# Altium project STM32F417 Demo Board.PrjPcb (part 3 of 4)

## Sheet Ethernet.SchDoc
size A3; SheetNumber: 6; SheetTotal: 15
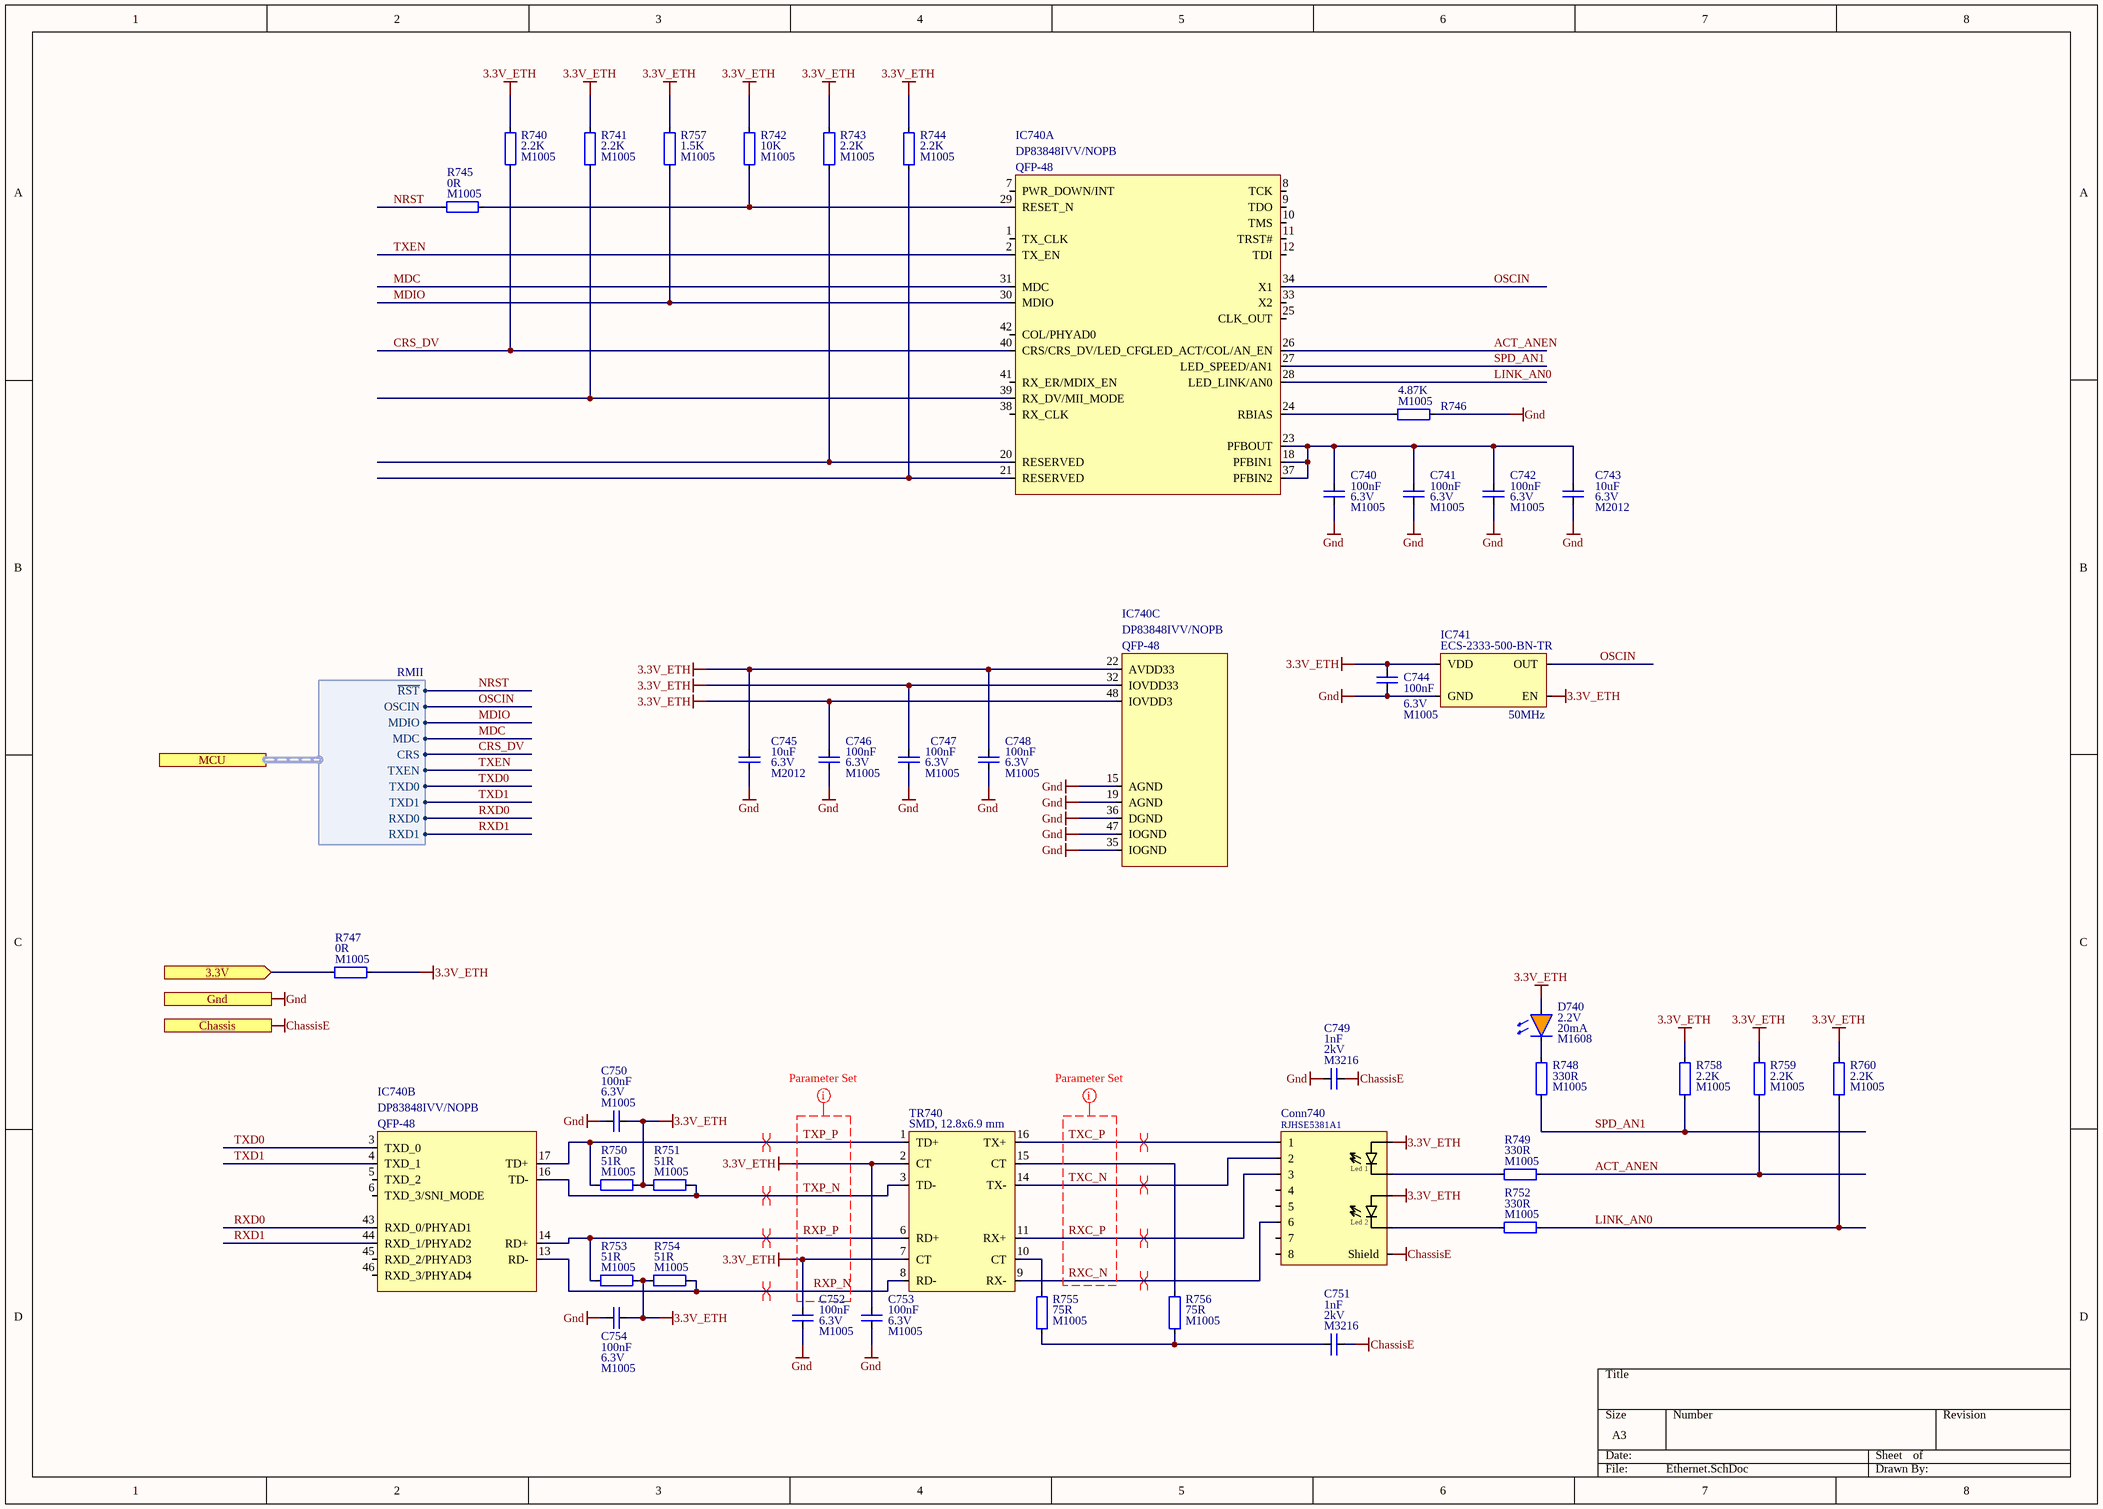
[diagram p9: Ethernet.SchDoc]

### Parts
C740  value 100nF  Voltage: 6.3V  Package: M1005  [Capacitor_Ceramic_M1005_I0402]  (hidden comment: Capacitor_Ceramic)
C741  value 100nF  Voltage: 6.3V  Package: M1005  [Capacitor_Ceramic_M1005_I0402]  (hidden comment: Capacitor_Ceramic)
C742  value 100nF  Voltage: 6.3V  Package: M1005  [Capacitor_Ceramic_M1005_I0402]  (hidden comment: Capacitor_Ceramic)
C743  value 10uF  Voltage: 6.3V  Package: M2012  [Capacitor_Ceramic_M2012_I0805]  (hidden comment: Capacitor_Ceramic)
C744  value 100nF  Voltage: 6.3V  Package: M1005  [Capacitor_Ceramic_M1005_I0402]  (hidden comment: Capacitor_Ceramic)
C745  value 10uF  Voltage: 6.3V  Package: M2012  [Capacitor_Ceramic_M2012_I0805]  (hidden comment: Capacitor_Ceramic)
C746  value 100nF  Voltage: 6.3V  Package: M1005  [Capacitor_Ceramic_M1005_I0402]  (hidden comment: Capacitor_Ceramic)
C747  value 100nF  Voltage: 6.3V  Package: M1005  [Capacitor_Ceramic_M1005_I0402]  (hidden comment: Capacitor_Ceramic)
C748  value 100nF  Voltage: 6.3V  Package: M1005  [Capacitor_Ceramic_M1005_I0402]  (hidden comment: Capacitor_Ceramic)
C749  value 1nF  Voltage: 2kV  Package: M3216  [Capacitor_Ceramic_M3216_I1206]  (hidden comment: Capacitor_Ceramic)
C750  value 100nF  Voltage: 6.3V  Package: M1005  [Capacitor_Ceramic_M1005_I0402]  (hidden comment: Capacitor_Ceramic)
C751  value 1nF  Voltage: 2kV  Package: M3216  [Capacitor_Ceramic_M3216_I1206]  (hidden comment: Capacitor_Ceramic)
C752  value 100nF  Voltage: 6.3V  Package: M1005  [Capacitor_Ceramic_M1005_I0402]  (hidden comment: Capacitor_Ceramic)
C753  value 100nF  Voltage: 6.3V  Package: M1005  [Capacitor_Ceramic_M1005_I0402]  (hidden comment: Capacitor_Ceramic)
C754  value 100nF  Voltage: 6.3V  Package: M1005  [Capacitor_Ceramic_M1005_I0402]  (hidden comment: Capacitor_Ceramic)
Conn740  Manufacturer Part Number: RJHSE5381A1  [RJ45 - Amphenol, RJHSE-x38x-A1]  (hidden comment: RJ45 - Amphenol, RJHSE-x38x-A1)
D740  Current: 20mA  Voltage: 2.2V  Package: M1608  [Diode_Smd_M1608_I0603_Orange1]  (hidden comment: Diode_Led)
IC740  Manufacturer Part Number: DP83848IVV/NOPB  Package: QFP-48  [QFP-48, 7mm x 7mm, 0.5mm]  (hidden comment: Ethernet - Texas, DP83848xVV)  (parts A,B,C of 3)
IC741  Frequency: 50MHz  Manufacturer Part Number: ECS-2333-500-BN-TR  [Clock Oscillator - ECS, ECS-2325, ECS-2333]  (hidden comment: Clock Oscillator - ECS, ECS-2325, ECS-2333)
R740  value 2.2K  Package: M1005  [Resistor_Smd_M1005_I0402]  (hidden comment: Resistor)
R741  value 2.2K  Package: M1005  [Resistor_Smd_M1005_I0402]  (hidden comment: Resistor)
R742  value 10K  Package: M1005  [Resistor_Smd_M1005_I0402]  (hidden comment: Resistor)
R743  value 2.2K  Package: M1005  [Resistor_Smd_M1005_I0402]  (hidden comment: Resistor)
R744  value 2.2K  Package: M1005  [Resistor_Smd_M1005_I0402]  (hidden comment: Resistor)
R745  value 0R  Package: M1005  [Resistor_Smd_M1005_I0402]  (hidden comment: Resistor)
R746  value 4.87K  Package: M1005  [Resistor_Smd_M1005_I0402]  (hidden comment: Resistor)
R747  value 0R  Package: M1005  [Resistor_Smd_M1005_I0402]  (hidden comment: Resistor)
R748  value 330R  Package: M1005  [Resistor_Smd_M1005_I0402]  (hidden comment: Resistor)
R749  value 330R  Package: M1005  [Resistor_Smd_M1005_I0402]  (hidden comment: Resistor)
R750  value 51R  Package: M1005  [Resistor_Smd_M1005_I0402]  (hidden comment: Resistor)
R751  value 51R  Package: M1005  [Resistor_Smd_M1005_I0402]  (hidden comment: Resistor)
R752  value 330R  Package: M1005  [Resistor_Smd_M1005_I0402]  (hidden comment: Resistor)
R753  value 51R  Package: M1005  [Resistor_Smd_M1005_I0402]  (hidden comment: Resistor)
R754  value 51R  Package: M1005  [Resistor_Smd_M1005_I0402]  (hidden comment: Resistor)
R755  value 75R  Package: M1005  [Resistor_Smd_M1005_I0402]  (hidden comment: Resistor)
R756  value 75R  Package: M1005  [Resistor_Smd_M1005_I0402]  (hidden comment: Resistor)
R757  value 1.5K  Package: M1005  [Resistor_Smd_M1005_I0402]  (hidden comment: Resistor)
R758  value 2.2K  Package: M1005  [Resistor_Smd_M1005_I0402]  (hidden comment: Resistor)
R759  value 2.2K  Package: M1005  [Resistor_Smd_M1005_I0402]  (hidden comment: Resistor)
R760  value 2.2K  Package: M1005  [Resistor_Smd_M1005_I0402]  (hidden comment: Resistor)
TR740  Package: SMD, 12.8x6.9 mm  [Transformer, Pulse - Bourns, SM13126PEL]  (hidden comment: Transformer, Pulse - Bourns, SM13126PEL)

### Ports
3.3V (in), Chassis (in), Gnd (in), MCU (harness RMII)

### Harnesses
RMII: ~{RST}, OSCIN, MDIO, CRS, MDC, TXEN, TXD0, TXD1, RXD0, RXD1

### Nets
3.3V: R747.1 ; port 3.3V
3.3V_ETH: C744.1 C745.1 C746.1 C747.1 C748.1 C750.2 C752.1 C753.1 C754.2 Conn740.L1-A Conn740.L2-A D740.A IC740.22(AVDD33) IC740.32(IOVDD33) IC740.48(IOVDD3) IC741.EN IC741.VDD R740.1 R741.1 R742.1 R743.1 R744.1 R747.2 R750.2 R751.1 R753.2 R754.1 R757.1 R758.1 R759.1 R760.1 TR740.2(CT) TR740.7(CT)
ChassisE: C749.2 C751.2 Conn740.Shield ; port Chassis
Gnd: C740.2 C741.2 C742.2 C743.2 C744.2 C745.2 C746.2 C747.2 C748.2 C749.1 C750.1 C752.2 C753.2 C754.1 IC740.15(AGND) IC740.19(AGND) IC740.35(IOGND) IC740.36(DGND) IC740.47(IOGND) IC741.GND R746.2 ; port Gnd
ACT_ANEN: IC740.26(LED_ACT/COL/AN_EN) R749.2 R759.2
CRS_DV: IC740.40(CRS/CRS_DV/LED_CFG) R740.2 ; port MCU.CRS
LINK_AN0: IC740.28(LED_LINK/AN0) R752.2 R760.2
MDC: IC740.31(MDC) ; port MCU.MDC
MDIO: IC740.30(MDIO) R757.2 ; port MCU.MDIO
NRST: R745.1 ; port MCU.~{RST}
OSCIN: IC740.34(X1) IC741.OUT ; port MCU.OSCIN
RXC_N: Conn740.6 TR740.9(RX-)
RXC_P: Conn740.3 TR740.11(RX+)
RXD0: IC740.43(RXD_0/PHYAD1) ; port MCU.RXD0  [project net PC4]
RXD1: IC740.44(RXD_1/PHYAD2) ; port MCU.RXD1  [project net PC5]
RXP_N: IC740.13(RD-) R754.2 TR740.8(RD-)
RXP_P: IC740.14(RD+) R753.1 TR740.6(RD+)
SPD_AN1: IC740.27(LED_SPEED/AN1) R748.2 R758.2
TXC_N: Conn740.2 TR740.14(TX-)
TXC_P: Conn740.1 TR740.16(TX+)
TXD0: IC740.3(TXD_0) ; port MCU.TXD0  [project net PB12]
TXD1: IC740.4(TXD_1) ; port MCU.TXD1  [project net PB13]
TXEN: IC740.2(TX_EN) ; port MCU.TXEN  [project net PB11]
TXP_N: IC740.16(TD-) R751.2 TR740.3(TD-)
TXP_P: IC740.17(TD+) R750.1 TR740.1(TD+)
NetC740_1: C740.1 C741.1 C742.1 C743.1 IC740.18(PFBIN1) IC740.23(PFBOUT) IC740.37(PFBIN2)
NetC751_1: C751.1 R755.2 R756.2
NetConn740_L1-C: Conn740.L1-C R749.1
NetConn740_L2-C: Conn740.L2-C R752.1
NetD740_C: D740.C R748.1
NetIC740_20: IC740.20(RESERVED) R743.2
NetIC740_21: IC740.21(RESERVED) R744.2
NetIC740_24: IC740.24(RBIAS) R746.1
NetIC740_29: IC740.29(RESET_N) R742.2 R745.2
NetIC740_39: IC740.39(RX_DV/MII_MODE) R741.2
NetR755_1: R755.1 TR740.10(CT)
NetR756_1: R756.1 TR740.15(CT)

Not connected (* = marked no-connect by the designer): Conn740 4 5 7 8; IC740 1(TX_CLK) 5(TXD_2) 6(TXD_3/SNI_MODE) 7(PWR_DOWN/INT) 8(TCK) 9(TDO) 10(TMS) 11(TRST#) 12(TDI) 25(CLK_OUT) 33(X2) 38(RX_CLK) 41(RX_ER/MDIX_EN) 42(COL/PHYAD0) 45(RXD_2/PHYAD3) 46(RXD_3/PHYAD4)

### Layout directives
differential pair; differential pair class Eth_100: RXC_N, RXC_P, RXP_N, RXP_P, TXC_N, TXC_P, TXP_N, TXP_P
net class EthP: RXP_N, RXP_P, TXP_N, TXP_P
net class EthC: RXC_N, RXC_P, TXC_N, TXC_P

### Notes on the sheet
- (in symbol RJ45 - Amphenol, RJHSE-x38x-A1) Led 1; Led 2

### Library data of the parts
C740-C742 C744 C746-C748 C750 C752-C754 = Capacitor_Ceramic: as C700 on sheet Microcontroller; ComponentLink1Description: Datasheet; ComponentLink1URL: E:\Altium\Datasheets\Capacitor\Kyocera - X5R.pdf; ComponentLink2Description: Supplier Link; ComponentLink2URL: https://www.digikey.com/en/products/detail/kyocera-avx/04026D104KAT4A/8107673; Supplier: Digikey; Supplier Part Number: 478-11504-1-ND; Operating Temperature, Min: +85℃; Operating Temperature, Max: -55℃; Quantity, Min: 1; Quantity, Max: 250000; Price, Min: 0.1; Supplier Currency: $; Price, Max: 0.00189; Supplier Link: https://www.digikey.com/en/products/detail/kyocera-avx/04026D104KAT4A/8107673; Component Type: Ceramic; Component Category: Capacitor
C743 C745 = Capacitor_Ceramic: Cap, Cer, 10uF, 6.3V, M2012; Manufacturer Part Number: CL21A106MQFNNNE; Manufacturer: Samsung; Temperature Coefficient: X5R; Tolerance: 20%; ComponentLink1Description: Datasheet; ComponentLink1URL: E:\Altium\Datasheets\Capacitor\Samsung - Multi Layer Ceramic Capacitors.pdf; ComponentLink2Description: Supplier Link; ComponentLink2URL: https://www.digikey.com/en/products/detail/samsung-electro-mechanics/CL21A106MQFNNNE/3886956; Supplier: Digikey; Supplier Part Number: 1276-1298-1-ND; Operating Temperature, Min: +85℃; Operating Temperature, Max: -55℃; Quantity, Min: 1; Quantity, Max: 200000; Price, Min: 0.1; Supplier Currency: $; Price, Max: 0.0087; Supplier Link: https://www.digikey.com/en/products/detail/samsung-electro-mechanics/CL21A106MQFNNNE/3886956; Component Type: Ceramic; Component Category: Capacitor
C749 C751 = Capacitor_Ceramic: Cap, Cer, 1nF, 2kV, M3216; Manufacturer Part Number: CC1206MKX7RDBB102; Manufacturer: Yageo; Temperature Coefficient: X7R; Tolerance: 20%; ComponentLink1Description: Datasheet; ComponentLink1URL: E:\Altium\Datasheets\Capacitor\Yageo - Surface-Mount Ceramic Multilayer Capacitors.pdf; ComponentLink2Description: Supplier Link; ComponentLink2URL: https://www.digikey.com/en/products/detail/yageo/CC1206MKX7RDBB102/5884663; Supplier: Digikey; Supplier Part Number: 311-4501-1-ND; Operating Temperature, Min: +125℃; Operating Temperature, Max: -55℃; Quantity, Min: 1; Quantity, Max: 300000; Price, Min: 0.23; Supplier Currency: $; Price, Max: 0.03271; Supplier Link: https://www.digikey.com/en/products/detail/yageo/CC1206MKX7RDBB102/5884663; Component Type: Ceramic; Component Category: Capacitor
Conn740 = RJ45 - Amphenol, RJHSE-x38x-A1: Conn, RJ45, 2 Leds, Shielded, Side Entry; Component Category: Connector; ComponentLink1Description: Datasheet; ComponentLink1URL: E:\Altium\Datasheets\Connector - Registered Jack\RJ45 - Amphenol, RJHSE-x38x-A1.pdf; ComponentLink2Description: Supplier Link; ComponentLink2URL: https://www.digikey.com/en/products/detail/amphenol-cs-commercial-products/RJHSE5381A1/3083556; Supplier: Digikey; Supplier Part Number: RJHSE5381A1-ND; Manufacturer: Amphenol; Operating Temperature, Min: -55℃; Operating Temperature, Max: +85℃; Quantity, Min: 1; Quantity, Max: 2400; Price, Min: 1.51; Supplier Currency: $; Price, Max: 0.806; Supplier Link: https://www.digikey.com/en/products/detail/amphenol-cs-commercial-products/RJHSE5381A1/3083556; Component Type: PCB; Package: RJ45
D740 = Diode_Led: Diode, Led, Orange, 2.2V, 20mA, M1608; Manufacturer Part Number: SML-D12D1WT86; Manufacturer: Rohm; ComponentLink1Description: Datasheet; ComponentLink1URL: E:\Altium\Datasheets\Diode\Rohm, SML-D12x1 Series.pdf; ComponentLink2Description: Supplier Link; ComponentLink2URL: https://www.digikey.com/en/products/detail/rohm-semiconductor/SML-D12D1WT86/5843854; Supplier: Digikey; Supplier Part Number: SML-D12D1WT86CT-ND; Operating Temperature, Min: -40℃; Operating Temperature, Max: +85℃; Quantity, Min: 1; Quantity, Max: 75000; Price, Min: 0.25; Price, Max: 0.02838; Supplier Currency: $; Supplier Link: https://www.digikey.com/en/products/detail/rohm-semiconductor/SML-D12D1WT86/5843854; Component Type: Led; Component Category: Diode
IC740 = Ethernet - Texas, DP83848xVV: IC, Interface, Eth Phy, 10/100Mb, DP83848IVV; ComponentLink1Description: Datasheet; ComponentLink1URL: E:\Altium\Datasheets\IC - Interface\Ethernet - Texas, DP83848.pdf; ComponentLink2Description: Supplier Link; ComponentLink2URL: https://www.digikey.com/en/products/detail/texas-instruments/DP83848IVV-NOPB/947543; Supplier: Digikey; Supplier Part Number: DP83848IVV/NOPB-ND; Manufacturer: Texas; Operating Temperature, Min: -40℃; Operating Temperature, Max: +85℃; Quantity, Min: 1; Quantity, Max: 1000; Price, Min: 6.45; Supplier Currency: $; Price, Max: 3.834; Supplier Link: https://www.digikey.com/en/products/detail/texas-instruments/DP83848IVV-NOPB/947543; Component Type: Interface; Component Category: IC
IC741 = Clock Oscillator - ECS, ECS-2325, ECS-2333: IC, Oscillator, 50MHz; ComponentLink1Description: Datasheet; ComponentLink1URL: E:\Altium\Datasheets\IC - Clock, Timing, Oscillator\Clock Oscillator - ECS, ECS-2325, ECS-2333.pdf; ComponentLink2Description: Supplier Link; ComponentLink2URL: https://www.digikey.com/en/products/detail/ecs-inc/ECS-2333-500-BN-TR/3927356; Supplier: Digikey; Supplier Part Number: XC1930CT-ND; Operating Temperature, Min: -40℃; Operating Temperature, Max: +85℃; Quantity, Min: 1; Quantity, Max: 10000; Price, Min: 1.24; Supplier Currency: $; Price, Max: 0.71656; Supplier Link: https://www.digikey.com/en/products/detail/ecs-inc/ECS-2333-500-BN-TR/3927356; Component Type: Clock, Timing, Oscillator; Component Category: IC; Manufacturer: ECS; Package: Flat, 3.2mm x 2.5mm
R740 R741 R743 R744 R758-R760 = Resistor: Res, 2.2K, 1%, M1005; Manufacturer: Yageo; Manufacturer Part Number: RC0402FR-072K2L; Component Category: Resistor; Component Type: Fixed Value; Tolerance: 1%; Supplier Link: https://www.digikey.com/en/products/detail/yageo/RC0402FR-072K2L/726553; Supplier Currency: $; Price, Max: 0.00129; Price, Min: 0.1; Quantity, Max: 100000; Quantity, Min: 1; Operating Temperature, Max: -55℃; Operating Temperature, Min: +155℃; Supplier Part Number: 311-2.20KLRCT-ND; Supplier: Digikey; ComponentLink1Description: Datasheet; ComponentLink1URL: E:\Altium\Datasheets\Resistor\Yageo - RC_L Series.pdf; ComponentLink2Description: Supplier Link; ComponentLink2URL: https://www.digikey.com/en/products/detail/yageo/RC0402FR-072K2L/726553
R742 = Resistor: as R706 on sheet Microcontroller; Component Category: Resistor; Component Type: Fixed Value; Tolerance: 1%; Supplier Link: https://www.digikey.com/en/products/detail/yageo/RC0402FR-0710KP/4935264; Supplier Currency: $; Price, Max: 0.00282; Price, Min: 0.1; Quantity, Max: 100000; Quantity, Min: 1; Operating Temperature, Max: -55℃; Operating Temperature, Min: +155℃; Supplier Part Number: YAG1249CT-ND; Supplier: Digikey; ComponentLink1Description: Datasheet; ComponentLink1URL: E:\Altium\Datasheets\Resistor\Yageo - RC_L Series.pdf; ComponentLink2Description: Supplier Link; ComponentLink2URL: https://www.digikey.com/en/products/detail/yageo/RC0402FR-0710KP/4935264
R745 R747 = Resistor: as R708 on sheet Microcontroller; Component Category: Resistor; Component Type: Fixed Value; Tolerance: *; Supplier Link: https://www.digikey.com/en/products/detail/yageo/RC0402FR-070RL/2827570; Supplier Currency: $; Price, Max: 0.00109; Price, Min: 0.1; Quantity, Max: 50000; Quantity, Min: 1; Operating Temperature, Max: -55℃; Operating Temperature, Min: +155℃; Supplier Part Number: 311-0.0LRCT-ND; Supplier: Digikey; ComponentLink1Description: Datasheet; ComponentLink1URL: E:\Altium\Datasheets\Resistor\Yageo - RC_L Series.pdf; ComponentLink2Description: Supplier Link; ComponentLink2URL: https://www.digikey.com/en/products/detail/yageo/RC0402FR-070RL/2827570
R746 = Resistor: Res, 4.87K, 1%, M1005; Manufacturer: Yageo; Manufacturer Part Number: RC0402FR-074K87L; Component Category: Resistor; Component Type: Fixed Value; Tolerance: 1%; Supplier Link: https://www.digikey.com/en/products/detail/yageo/RC0402FR-074K87L/5281035; Supplier Currency: $; Price, Max: 0.00129; Price, Min: 0.1; Quantity, Max: 100000; Quantity, Min: 1; Operating Temperature, Max: -55℃; Operating Temperature, Min: +155℃; Supplier Part Number: YAG3175CT-ND; Supplier: Digikey; ComponentLink1Description: Datasheet; ComponentLink1URL: E:\Altium\Datasheets\Resistor\Yageo - RC_L Series.pdf; ComponentLink2Description: Supplier Link; ComponentLink2URL: https://www.digikey.com/en/products/detail/yageo/RC0402FR-074K87L/5281035
R748 R749 R752 = Resistor: as R660 on sheet LCD; Component Category: Resistor; Component Type: Fixed Value; Tolerance: 1%; Supplier Link: https://www.digikey.com/en/products/detail/yageo/RC0402FR-07330RL/726594; Supplier Currency: $; Price, Max: 0.00129; Price, Min: 0.1; Quantity, Max: 100000; Quantity, Min: 1; Operating Temperature, Max: -55℃; Operating Temperature, Min: +155℃; Supplier Part Number: 311-330LRCT-ND; Supplier: Digikey; ComponentLink1Description: Datasheet; ComponentLink1URL: E:\Altium\Datasheets\Resistor\Yageo - RC_L Series.pdf; ComponentLink2Description: Supplier Link; ComponentLink2URL: https://www.digikey.com/en/products/detail/yageo/RC0402FR-07330RL/726594
R750 R751 R753 R754 = Resistor: Res, 51R, 1%, M1005; Manufacturer: Yageo; Manufacturer Part Number: RC0402FR-0751RL; Component Category: Resistor; Component Type: Fixed Value; Tolerance: 1%; Supplier Link: https://www.digikey.com/en/products/detail/yageo/RC0402FR-0751RL/726629; Supplier Currency: $; Price, Max: 0.00129; Price, Min: 0.1; Quantity, Max: 100000; Quantity, Min: 1; Operating Temperature, Max: -55℃; Operating Temperature, Min: +155℃; Supplier Part Number: 311-51.0LRCT-ND; Supplier: Digikey; ComponentLink1Description: Datasheet; ComponentLink1URL: E:\Altium\Datasheets\Resistor\Yageo - RC_L Series.pdf; ComponentLink2Description: Supplier Link; ComponentLink2URL: https://www.digikey.com/en/products/detail/yageo/RC0402FR-0751RL/726629
R755 R756 = Resistor: Res, 75R, 1%, M1005; Manufacturer: Yageo; Manufacturer Part Number: RC0402FR-0775RL; Component Category: Resistor; Component Type: Fixed Value; Tolerance: 1%; Supplier Link: https://www.digikey.com/en/products/detail/yageo/RC0402FR-0775RL/726658; Supplier Currency: $; Price, Max: 0.00129; Price, Min: 0.1; Quantity, Max: 100000; Quantity, Min: 1; Operating Temperature, Max: -55℃; Operating Temperature, Min: +155℃; Supplier Part Number: 311-75.0LRCT-ND; Supplier: Digikey; ComponentLink1Description: Datasheet; ComponentLink1URL: E:\Altium\Datasheets\Resistor\Yageo - RC_L Series.pdf; ComponentLink2Description: Supplier Link; ComponentLink2URL: https://www.digikey.com/en/products/detail/yageo/RC0402FR-0775RL/726658
R757 = Resistor: Res, 1.5K, 1%, M1005; Manufacturer: Yageo; Manufacturer Part Number: RC0402FR-071K5L; Component Category: Resistor; Component Type: Fixed Value; Tolerance: 1%; Supplier Link: https://www.digikey.com/en/products/detail/yageo/RC0402FR-071K5L/726519; Supplier Currency: $; Price, Max: 0.00129; Price, Min: 0.1; Quantity, Max: 100000; Quantity, Min: 1; Operating Temperature, Max: -55℃; Operating Temperature, Min: +155℃; Supplier Part Number: 311-1.50KLRCT-ND; Supplier: Digikey; ComponentLink1Description: Datasheet; ComponentLink1URL: E:\Altium\Datasheets\Resistor\Yageo - RC_L Series.pdf; ComponentLink2Description: Supplier Link; ComponentLink2URL: https://www.digikey.com/en/products/detail/yageo/RC0402FR-071K5L/726519
TR740 = Transformer, Pulse - Bourns, SM13126PEL: Transformer, Eth, 100Mbps, SM13126PEL; ComponentLink1Description: Datasheet; ComponentLink1URL: E:\Altium\Datasheets\Transformer\Transformer, Pulse - Bourns, SM51108PEL.pdf; ComponentLink2Description: Supplier Link; ComponentLink2URL: https://www.digikey.com/en/products/detail/bourns-inc/SM13126PEL/10229989; Manufacturer Part Number: SM13126PEL; Supplier: Digikey; Supplier Part Number: SM13126PELCT-ND; Manufacturer: Bourns; Operating Temperature, Min: -40℃; Operating Temperature, Max: +85℃; Quantity, Min: 1; Quantity, Max: 6000; Price, Min: 2.17; Price, Max: 1.05049; Supplier Currency: $; Supplier Link: https://www.digikey.com/en/products/detail/bourns-inc/SM13126PEL/10229989; Component Type: Pulse; Component Category: Transformer

## Sheet RS422.SchDoc
size A4; SheetNumber: 7; SheetTotal: 15
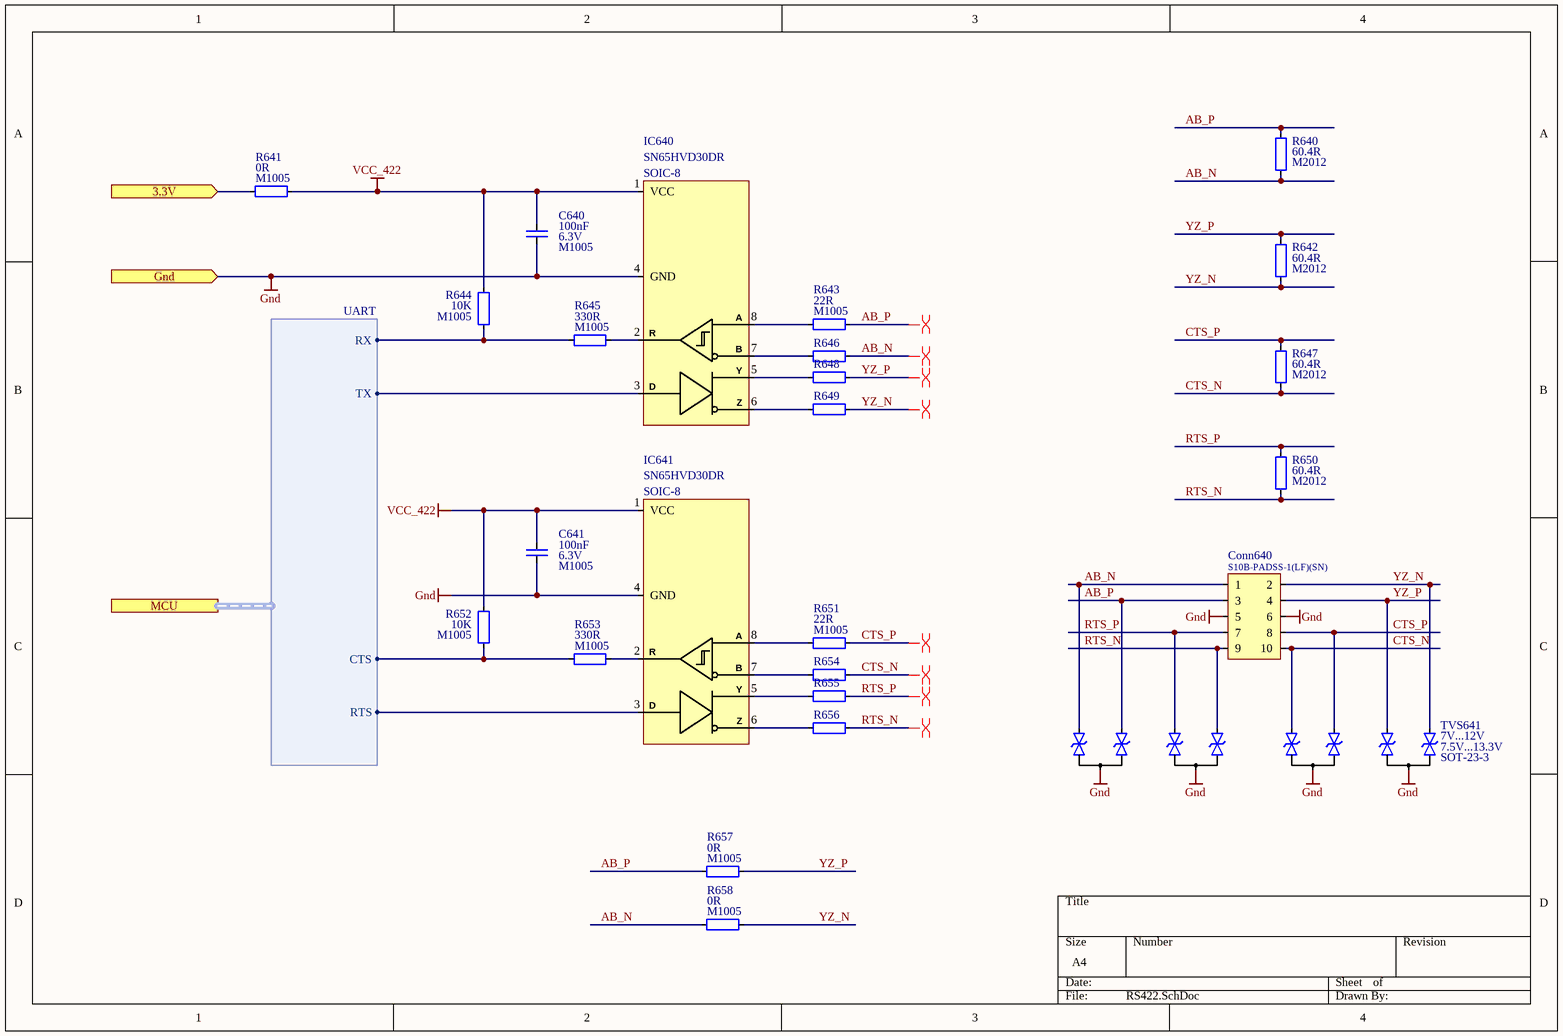
[diagram p10: RS422.SchDoc]

### Parts
C640  value 100nF  Voltage: 6.3V  Package: M1005  [Capacitor_Ceramic_M1005_I0402]  (hidden comment: Capacitor_Ceramic)
C641  value 100nF  Voltage: 6.3V  Package: M1005  [Capacitor_Ceramic_M1005_I0402]  (hidden comment: Capacitor_Ceramic)
Conn640  Manufacturer Part Number: S10B-PADSS-1(LF)(SN)  [Connector, S10B-PADSS-1]  (hidden comment: Connector - 10P)
IC640  Manufacturer Part Number: SN65HVD30DR  Package: SOIC-8  [SOIC-8, NB]  (hidden comment: RS422 - Texas, SN65HVD30D)
IC641  Manufacturer Part Number: SN65HVD30DR  Package: SOIC-8  [SOIC-8, NB]  (hidden comment: RS422 - Texas, SN65HVD30D)
R640  value 60.4R  Package: M2012  [Resistor_Smd_M2012_I0805]  (hidden comment: Resistor)
R641  value 0R  Package: M1005  [Resistor_Smd_M1005_I0402]  (hidden comment: Resistor)
R642  value 60.4R  Package: M2012  [Resistor_Smd_M2012_I0805]  (hidden comment: Resistor)
R643  value 22R  Package: M1005  [Resistor_Smd_M1005_I0402]  (hidden comment: Resistor)
R644  value 10K  Package: M1005  [Resistor_Smd_M1005_I0402]  (hidden comment: Resistor)
R645  value 330R  Package: M1005  [Resistor_Smd_M1005_I0402]  (hidden comment: Resistor)
R646  Resistor  [Resistor_Smd_M1005_I0402]  (value not drawn)
R647  value 60.4R  Package: M2012  [Resistor_Smd_M2012_I0805]  (hidden comment: Resistor)
R648  Resistor  [Resistor_Smd_M1005_I0402]  (value not drawn)
R649  Resistor  [Resistor_Smd_M1005_I0402]  (value not drawn)
R650  value 60.4R  Package: M2012  [Resistor_Smd_M2012_I0805]  (hidden comment: Resistor)
R651  value 22R  Package: M1005  [Resistor_Smd_M1005_I0402]  (hidden comment: Resistor)
R652  value 10K  Package: M1005  [Resistor_Smd_M1005_I0402]  (hidden comment: Resistor)
R653  value 330R  Package: M1005  [Resistor_Smd_M1005_I0402]  (hidden comment: Resistor)
R654  Resistor  [Resistor_Smd_M1005_I0402]  (value not drawn)
R655  Resistor  [Resistor_Smd_M1005_I0402]  (value not drawn)
R656  Resistor  [Resistor_Smd_M1005_I0402]  (value not drawn)
R657  value 0R  Package: M1005  [Resistor_Smd_M1005_I0402]  (hidden comment: Resistor)
R658  value 0R  Package: M1005  [Resistor_Smd_M1005_I0402]  (hidden comment: Resistor)
TVS640  Diode_Tvs_2P_Bidirectional  [Diode_SOT-23-3_2P_Bidirectional_Type_1]  (value not drawn)
TVS641  Voltage, Break Down: 7.5V...13.3V  Voltage, Stand Off: 7V...12V  Package: SOT-23-3  [Diode_SOT-23-3_2P_Bidirectional_Type_1]  (hidden comment: Diode_Tvs_2P_Bidirectional)
TVS642  Diode_Tvs_2P_Bidirectional  [Diode_SOT-23-3_2P_Bidirectional_Type_1]  (value not drawn)
TVS643  Diode_Tvs_2P_Bidirectional  [Diode_SOT-23-3_2P_Bidirectional_Type_1]  (value not drawn)

### Ports
3.3V (in), Gnd (in), MCU (harness UART)

### Harnesses
UART: RX, TX, RTS, CTS

### Nets
3.3V: R641.1 ; port 3.3V
Gnd: C640.2 C641.2 Conn640.5 Conn640.6 IC640.4(GND) IC641.4(GND) TVS640.Common TVS641.Common TVS642.Common TVS643.Common ; port Gnd
VCC_422: C640.1 C641.1 IC640.1(VCC) IC641.1(VCC) R641.2 R644.2 R652.2
AB_N: Conn640.1 R640.2 R646.2 R658.1 TVS642.D1
AB_P: Conn640.3 R640.1 R643.2 R657.1 TVS642.D2
CTS_N: Conn640.10 R647.2 R654.2 TVS643.D1
CTS_P: Conn640.8 R647.1 R651.2 TVS643.D2
PA9: IC640.3(D) ; port MCU.TX
PA10: R644.1 R645.1 ; port MCU.RX
PA11: R652.1 R653.1 ; port MCU.CTS
PA12: IC641.3(D) ; port MCU.RTS
RTS_N: Conn640.9 R650.2 R656.2 TVS640.D2
RTS_P: Conn640.7 R650.1 R655.2 TVS640.D1
YZ_N: Conn640.2 R642.2 R649.2 R658.2 TVS641.D2
YZ_P: Conn640.4 R642.1 R648.2 R657.2 TVS641.D1
NetIC640_2: IC640.2(R) R645.2
NetIC640_5: IC640.5(Y) R648.1
NetIC640_6: IC640.6(Z) R649.1
NetIC640_7: IC640.7(B) R646.1
NetIC640_8: IC640.8(A) R643.1
NetIC641_2: IC641.2(R) R653.2
NetIC641_5: IC641.5(Y) R655.1
NetIC641_6: IC641.6(Z) R656.1
NetIC641_7: IC641.7(B) R654.1
NetIC641_8: IC641.8(A) R651.1

### Layout directives
differential pair; differential pair class Rs422_120: AB_N, AB_P, CTS_N, CTS_P, RTS_N, RTS_P, YZ_N, YZ_P

### Library data of the parts
C640 C641 = Capacitor_Ceramic: Cap, Cer, 100nF, 6.3V, M1005; Manufacturer Part Number: 04026D104KAT4A; Manufacturer: Kyocera; Temperature Coefficient: X5R; Tolerance: 10%; ComponentLink1Description: Datasheet; ComponentLink1URL: E:\Altium\Datasheets\Capacitor\Kyocera - X5R.pdf; ComponentLink2Description: Supplier Link; ComponentLink2URL: https://www.digikey.com/en/products/detail/kyocera-avx/04026D104KAT4A/8107673; Supplier: Digikey; Supplier Part Number: 478-11504-1-ND; Operating Temperature, Min: +85℃; Operating Temperature, Max: -55℃; Quantity, Min: 1; Quantity, Max: 250000; Price, Min: 0.1; Supplier Currency: $; Price, Max: 0.00189; Supplier Link: https://www.digikey.com/en/products/detail/kyocera-avx/04026D104KAT4A/8107673; Component Type: Ceramic; Component Category: Capacitor
Conn640 = Connector - 10P: Conn, JST, 10P, TH, PAD, Side Entry; ComponentLink1Description: Datasheet; ComponentLink1URL: E:\Altium\Datasheets\Connector - JST\PAD Family.pdf; ComponentLink2Description: Supplier Link; ComponentLink2URL: https://www.digikey.com/en/products/detail/jst-sales-america-inc/S10B-PADSS-1-LF-SN/1634773; Supplier: Digikey; Supplier Part Number: 455-2032-ND; Manufacturer: JST; Operating Temperature, Min: -25℃; Operating Temperature, Max: +85℃; Quantity, Min: 1; Quantity, Max: 10080; Price, Min: 0.65; Supplier Currency: $; Price, Max: 0.27565; Supplier Link: https://www.digikey.com/en/products/detail/jst-sales-america-inc/S10B-PADSS-1-LF-SN/1634773; Component Type: PCB; Component Category: Connector; Package: TH, 2 Rows, RA, Side Entry
IC640 IC641 = RS422 - Texas, SN65HVD30D: IC, Interface, RS422, SOIC-8; ComponentLink1Description: Datasheet; ComponentLink1URL: E:\Altium\Datasheets\IC - Interface\RS422 - Texas, SN65HVD3x.pdf; ComponentLink2Description: Supplier Link; Supplier: Digikey; Supplier Part Number: 296-19625-1-ND; Manufacturer: Texas; Operating Temperature, Min: -55℃; Operating Temperature, Max: +85℃; Quantity, Min: 1; Quantity, Max: 2500; Price, Min: 4.32; Supplier Currency: $; Price, Max: 2.16943; Supplier Link: https://www.digikey.com/en/products/detail/texas-instruments/SN65HVD30DR/1016459; Component Type: Interface; Component Category: IC
  IC640: ComponentLink2URL: https://www.digikey.com/en/products/detail/texas-instruments/SN65HVD30DR/1016459
  IC641: ComponentLink2URL: https://www.digikey.com/en/products/detail/texas-instruments/SN65HVD30D/1574539
R640 R642 R647 R650 = Resistor: Res, 60.4R, 1%, M1005; Manufacturer: Yageo; Manufacturer Part Number: RC0805FR-0760R4L; Component Category: Resistor; Component Type: Fixed Value; Tolerance: 1%; Supplier Link: https://www.digikey.com/en/products/detail/yageo/RC0805FR-0760R4L/728073; Supplier Currency: $; Price, Max: 0.00328; Price, Min: 0.1; Quantity, Max: 125000; Quantity, Min: 1; Operating Temperature, Max: -55℃; Operating Temperature, Min: +155℃; Supplier Part Number: 311-60.4CRCT-ND; Supplier: Digikey; ComponentLink1Description: Datasheet; ComponentLink1URL: E:\Altium\Datasheets\Resistor\Yageo - RC_L Series.pdf; ComponentLink2Description: Supplier Link; ComponentLink2URL: https://www.digikey.com/en/products/detail/yageo/RC0805FR-0760R4L/728073
R641 R657 R658 = Resistor: Res, 0R, M1005; Manufacturer: Yageo; Manufacturer Part Number: RC0402FR-070RL; Component Category: Resistor; Component Type: Fixed Value; Tolerance: *; Supplier Link: https://www.digikey.com/en/products/detail/yageo/RC0402FR-070RL/2827570; Supplier Currency: $; Price, Max: 0.00109; Price, Min: 0.1; Quantity, Max: 50000; Quantity, Min: 1; Operating Temperature, Max: -55℃; Operating Temperature, Min: +155℃; Supplier Part Number: 311-0.0LRCT-ND; Supplier: Digikey; ComponentLink1Description: Datasheet; ComponentLink1URL: E:\Altium\Datasheets\Resistor\Yageo - RC_L Series.pdf; ComponentLink2Description: Supplier Link; ComponentLink2URL: https://www.digikey.com/en/products/detail/yageo/RC0402FR-070RL/2827570
R643 R646 R648 R649 R651 R654-R656 = Resistor: Res, 22R, 1%, M1005; Manufacturer: Yageo; Manufacturer Part Number: RC0402FR-0722RL; Component Category: Resistor; Component Type: Fixed Value; Tolerance: 1%; Supplier Link: https://www.digikey.com/en/products/detail/yageo/RC0402FR-0722RL/726562; Supplier Currency: $; Price, Max: 0.00129; Price, Min: 0.1; Quantity, Max: 100000; Quantity, Min: 1; Operating Temperature, Max: -55℃; Operating Temperature, Min: +155℃; Supplier Part Number: 311-22.0LRCT-ND; Supplier: Digikey; ComponentLink1Description: Datasheet; ComponentLink1URL: E:\Altium\Datasheets\Resistor\Yageo - RC_L Series.pdf; ComponentLink2Description: Supplier Link; ComponentLink2URL: https://www.digikey.com/en/products/detail/yageo/RC0402FR-0722RL/726562
  R646 R648 R649 R654-R656: Value: 22R; Package: M1005
R644 R652 = Resistor: Res, 10K, 1%, M1005; Manufacturer: Yageo; Manufacturer Part Number: RC0402FR-0710KP; Component Category: Resistor; Component Type: Fixed Value; Tolerance: 1%; Supplier Link: https://www.digikey.com/en/products/detail/yageo/RC0402FR-0710KP/4935264; Supplier Currency: $; Price, Max: 0.00282; Price, Min: 0.1; Quantity, Max: 100000; Quantity, Min: 1; Operating Temperature, Max: -55℃; Operating Temperature, Min: +155℃; Supplier Part Number: YAG1249CT-ND; Supplier: Digikey; ComponentLink1Description: Datasheet; ComponentLink1URL: E:\Altium\Datasheets\Resistor\Yageo - RC_L Series.pdf; ComponentLink2Description: Supplier Link; ComponentLink2URL: https://www.digikey.com/en/products/detail/yageo/RC0402FR-0710KP/4935264
R645 R653 = Resistor: Res, 330R, 1%, M1005; Manufacturer: Yageo; Manufacturer Part Number: RC0402FR-07330RL; Component Category: Resistor; Component Type: Fixed Value; Tolerance: 1%; Supplier Link: https://www.digikey.com/en/products/detail/yageo/RC0402FR-07330RL/726594; Supplier Currency: $; Price, Max: 0.00129; Price, Min: 0.1; Quantity, Max: 100000; Quantity, Min: 1; Operating Temperature, Max: -55℃; Operating Temperature, Min: +155℃; Supplier Part Number: 311-330LRCT-ND; Supplier: Digikey; ComponentLink1Description: Datasheet; ComponentLink1URL: E:\Altium\Datasheets\Resistor\Yageo - RC_L Series.pdf; ComponentLink2Description: Supplier Link; ComponentLink2URL: https://www.digikey.com/en/products/detail/yageo/RC0402FR-07330RL/726594
TVS640 TVS642 TVS643 = Diode_Tvs_2P_Bidirectional: TVS, 2P, Bidirectional, 7V/12V, SOT-23-3; Manufacturer Part Number: CDSOT23-SM712; Manufacturer: Bourns; Component Category: Diode; Voltage, Break Down: 7.5V...13.3V; Voltage, Stand Off: 7V...12V; ComponentLink1Description: Datasheet; ComponentLink1URL: E:\Altium\Datasheets\Diode\Bourns, CDSOT23-SM712.pdf; ComponentLink2Description: Supplier Link; ComponentLink2URL: https://www.digikey.com/en/products/detail/bourns-inc/CDSOT23-SM712/1630592; Supplier: Digikey; Supplier Part Number: CDSOT23-SM712CT-ND; Operating Temperature, Min: -55℃; Operating Temperature, Max: +150℃; Quantity, Min: 1; Quantity, Max: 3000; Price, Min: 1.59; Price, Max: 0.675; Supplier Currency: $; Supplier Link: https://www.digikey.com/en/products/detail/bourns-inc/CDSOT23-SM712/1630592; Component Type: TVS; Package: SOT-23-3
TVS641 = Diode_Tvs_2P_Bidirectional: TVS, 2P, Bidirectional, 7V/12V, SOT-23-3; Manufacturer Part Number: CDSOT23-SM712; Manufacturer: Bourns; Component Category: Diode; ComponentLink1Description: Datasheet; ComponentLink1URL: E:\Altium\Datasheets\Diode\Bourns, CDSOT23-SM712.pdf; ComponentLink2Description: Supplier Link; ComponentLink2URL: https://www.digikey.com/en/products/detail/bourns-inc/CDSOT23-SM712/1630592; Supplier: Digikey; Supplier Part Number: CDSOT23-SM712CT-ND; Operating Temperature, Min: -55℃; Operating Temperature, Max: +150℃; Quantity, Min: 1; Quantity, Max: 3000; Price, Min: 1.59; Price, Max: 0.675; Supplier Currency: $; Supplier Link: https://www.digikey.com/en/products/detail/bourns-inc/CDSOT23-SM712/1630592; Component Type: TVS

## Sheet RS232.SchDoc
size A4; SheetNumber: 3; SheetTotal: 15
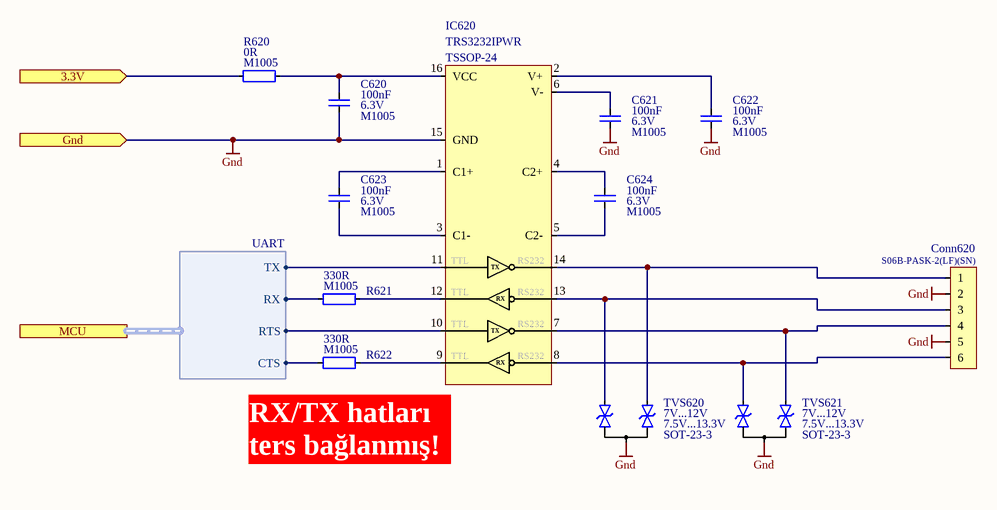
[diagram p11: RS232.SchDoc]

### Parts
C620  value 100nF  Voltage: 6.3V  Package: M1005  [Capacitor_Ceramic_M1005_I0402]  (hidden comment: Capacitor_Ceramic)
C621  value 100nF  Voltage: 6.3V  Package: M1005  [Capacitor_Ceramic_M1005_I0402]  (hidden comment: Capacitor_Ceramic)
C622  value 100nF  Voltage: 6.3V  Package: M1005  [Capacitor_Ceramic_M1005_I0402]  (hidden comment: Capacitor_Ceramic)
C623  value 100nF  Voltage: 6.3V  Package: M1005  [Capacitor_Ceramic_M1005_I0402]  (hidden comment: Capacitor_Ceramic)
C624  value 100nF  Voltage: 6.3V  Package: M1005  [Capacitor_Ceramic_M1005_I0402]  (hidden comment: Capacitor_Ceramic)
Conn620  Manufacturer Part Number: S06B-PASK-2(LF)(SN)  [Connector, S06B-PASK-2]  (hidden comment: Connector - 6P)
IC620  Manufacturer Part Number: TRS3232IPWR  Package: TSSOP-24  [TSSOP-16]  (hidden comment: RS232 - Texas, TRS3232IPWR)
R620  value 0R  Package: M1005  [Resistor_Smd_M1005_I0402]  (hidden comment: Resistor)
R621  value 330R  Package: M1005  [Resistor_Smd_M1005_I0402]  (hidden comment: Resistor)
R622  value 330R  Package: M1005  [Resistor_Smd_M1005_I0402]  (hidden comment: Resistor)
TVS620  Voltage, Break Down: 7.5V...13.3V  Voltage, Stand Off: 7V...12V  Package: SOT-23-3  [Diode_SOT-23-3_2P_Bidirectional_Type_1]  (hidden comment: Diode_Tvs_2P_Bidirectional)
TVS621  Voltage, Break Down: 7.5V...13.3V  Voltage, Stand Off: 7V...12V  Package: SOT-23-3  [Diode_SOT-23-3_2P_Bidirectional_Type_1]  (hidden comment: Diode_Tvs_2P_Bidirectional)

### Ports
3.3V (in), Gnd (in), MCU (harness UART)

### Harnesses
UART: RX, TX, RTS, CTS

### Nets
3.3V: R620.1 ; port 3.3V
Gnd: C620.2 C621.2 C622.2 Conn620.2 Conn620.5 IC620.15(GND) TVS620.Common TVS621.Common ; port Gnd
PA0: R622.1 ; port MCU.CTS
PA3: R621.1 ; port MCU.RX
PD4: IC620.10(DIN2) ; port MCU.RTS
PD5: IC620.11(DIN1) ; port MCU.TX
NetC620_1: C620.1 IC620.16(VCC) R620.2
NetC621_1: C621.1 IC620.6(V-)
NetC622_1: C622.1 IC620.2(V+)
NetC623_1: C623.1 IC620.1(C1+)
NetC623_2: C623.2 IC620.3(C1-)
NetC624_1: C624.1 IC620.4(C2+)
NetC624_2: C624.2 IC620.5(C2-)
NetConn620_1: Conn620.1 IC620.14(DOUT1) TVS620.D2
NetConn620_3: Conn620.3 IC620.13(RIN1) TVS620.D1
NetConn620_4: Conn620.4 IC620.7(DOUT2) TVS621.D2
NetConn620_6: Conn620.6 IC620.8(RIN2) TVS621.D1
NetIC620_9: IC620.9(ROUT2) R622.2
NetIC620_12: IC620.12(ROUT1) R621.2

### Notes on the sheet
- RX/TX hatları ters bağlanmış!
- (in symbol RS232 - Texas, TRS3232IPWR) TTL; TX; RS232; RX

### Library data of the parts
C620-C624 = Capacitor_Ceramic: as C640 on sheet RS422; ComponentLink1Description: Datasheet; ComponentLink1URL: E:\Altium\Datasheets\Capacitor\Kyocera - X5R.pdf; ComponentLink2Description: Supplier Link; ComponentLink2URL: https://www.digikey.com/en/products/detail/kyocera-avx/04026D104KAT4A/8107673; Supplier: Digikey; Supplier Part Number: 478-11504-1-ND; Operating Temperature, Min: +85℃; Operating Temperature, Max: -55℃; Quantity, Min: 1; Quantity, Max: 250000; Price, Min: 0.1; Supplier Currency: $; Price, Max: 0.00189; Supplier Link: https://www.digikey.com/en/products/detail/kyocera-avx/04026D104KAT4A/8107673; Component Type: Ceramic; Component Category: Capacitor
Conn620 = Connector - 6P: Conn, JST, 6P, TH, PA, Side Entry; ComponentLink1Description: Datasheet; ComponentLink1URL: E:\Altium\Datasheets\Connector - JST\PA Family.pdf; ComponentLink2Description: Supplier Link; ComponentLink2URL: https://www.digikey.com/en/products/detail/jst-sales-america-inc/S06B-PASK-2-LF-SN/926757; Supplier: Digikey; Supplier Part Number: 455-1851-ND; Manufacturer: JST; Operating Temperature, Min: -25℃; Operating Temperature, Max: +85℃; Quantity, Min: 1; Quantity, Max: 10000; Price, Min: 0.51; Supplier Currency: $; Price, Max: 0.21423; Supplier Link: https://www.digikey.com/en/products/detail/jst-sales-america-inc/S06B-PASK-2-LF-SN/926757; Component Type: PCB; Component Category: Connector; Package: TH, Side
IC620 = RS232 - Texas, TRS3232IPWR: IC, Interface, RS232, TSSOP-24; ComponentLink1Description: Datasheet; ComponentLink1URL: E:\Altium\Datasheets\IC - Interface\RS232 - Texas, TRS3232.pdf; ComponentLink2Description: Supplier Link; ComponentLink2URL: https://www.digikey.com/en/products/detail/texas-instruments/TRS3232IPWR/1909117; Supplier: Digikey; Supplier Part Number: 296-25041-1-ND; Manufacturer: Texas; Operating Temperature, Min: -55℃; Operating Temperature, Max: +85℃; Quantity, Min: 1; Quantity, Max: 2000; Price, Min: 1.95; Supplier Currency: $; Price, Max: 0.9984; Supplier Link: https://www.digikey.com/en/products/detail/texas-instruments/TRS3232IPWR/1909117; Component Type: Interface; Component Category: IC
R620 = Resistor: as R641 on sheet RS422; Component Category: Resistor; Component Type: Fixed Value; Tolerance: *; Supplier Link: https://www.digikey.com/en/products/detail/yageo/RC0402FR-070RL/2827570; Supplier Currency: $; Price, Max: 0.00109; Price, Min: 0.1; Quantity, Max: 50000; Quantity, Min: 1; Operating Temperature, Max: -55℃; Operating Temperature, Min: +155℃; Supplier Part Number: 311-0.0LRCT-ND; Supplier: Digikey; ComponentLink1Description: Datasheet; ComponentLink1URL: E:\Altium\Datasheets\Resistor\Yageo - RC_L Series.pdf; ComponentLink2Description: Supplier Link; ComponentLink2URL: https://www.digikey.com/en/products/detail/yageo/RC0402FR-070RL/2827570
R621 R622 = Resistor: as R645 on sheet RS422; Component Category: Resistor; Component Type: Fixed Value; Tolerance: 1%; Supplier Link: https://www.digikey.com/en/products/detail/yageo/RC0402FR-07330RL/726594; Supplier Currency: $; Price, Max: 0.00129; Price, Min: 0.1; Quantity, Max: 100000; Quantity, Min: 1; Operating Temperature, Max: -55℃; Operating Temperature, Min: +155℃; Supplier Part Number: 311-330LRCT-ND; Supplier: Digikey; ComponentLink1Description: Datasheet; ComponentLink1URL: E:\Altium\Datasheets\Resistor\Yageo - RC_L Series.pdf; ComponentLink2Description: Supplier Link; ComponentLink2URL: https://www.digikey.com/en/products/detail/yageo/RC0402FR-07330RL/726594
TVS620 TVS621 = Diode_Tvs_2P_Bidirectional: as TVS641 on sheet RS422; ComponentLink1Description: Datasheet; ComponentLink1URL: E:\Altium\Datasheets\Diode\Bourns, CDSOT23-SM712.pdf; ComponentLink2Description: Supplier Link; ComponentLink2URL: https://www.digikey.com/en/products/detail/bourns-inc/CDSOT23-SM712/1630592; Supplier: Digikey; Supplier Part Number: CDSOT23-SM712CT-ND; Operating Temperature, Min: -55℃; Operating Temperature, Max: +150℃; Quantity, Min: 1; Quantity, Max: 3000; Price, Min: 1.59; Price, Max: 0.675; Supplier Currency: $; Supplier Link: https://www.digikey.com/en/products/detail/bourns-inc/CDSOT23-SM712/1630592; Component Type: TVS

## Sheet CAN.SchDoc
size A4; SheetNumber: 13; SheetTotal: 15
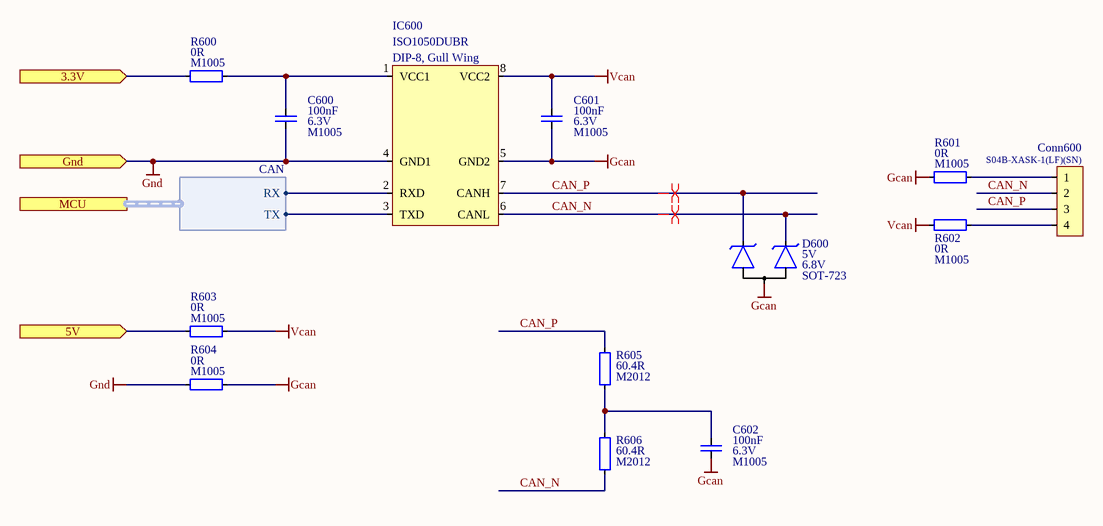
[diagram p12: CAN.SchDoc]

### Parts
C600  value 100nF  Voltage: 6.3V  Package: M1005  [Capacitor_Ceramic_M1005_I0402]  (hidden comment: Capacitor_Ceramic)
C601  value 100nF  Voltage: 6.3V  Package: M1005  [Capacitor_Ceramic_M1005_I0402]  (hidden comment: Capacitor_Ceramic)
C602  value 100nF  Voltage: 6.3V  Package: M1005  [Capacitor_Ceramic_M1005_I0402]  (hidden comment: Capacitor_Ceramic)
Conn600  Manufacturer Part Number: S04B-XASK-1(LF)(SN)  [Connector, S04B-XASK-1]  (hidden comment: Connector - 4P)
D600  Voltage, Break Down: 6.8V  Voltage, Stand Off: 5V  Package: SOT-723  [Diode_SOT-723_2P_Common_Anode_Type_1]  (hidden comment: Diode_Tvs_2P_Common_Anode)
IC600  Manufacturer Part Number: ISO1050DUBR  [DIP-8, Gull Wing]  (hidden comment: CAN - Texas, ISO1050DUB)
R600  value 0R  Package: M1005  [Resistor_Smd_M1005_I0402]  (hidden comment: Resistor)
R601  value 0R  Package: M1005  [Resistor_Smd_M1005_I0402]  (hidden comment: Resistor)
R602  value 0R  Package: M1005  [Resistor_Smd_M1005_I0402]  (hidden comment: Resistor)
R603  value 0R  Package: M1005  [Resistor_Smd_M1005_I0402]  (hidden comment: Resistor)
R604  value 0R  Package: M1005  [Resistor_Smd_M1005_I0402]  (hidden comment: Resistor)
R605  value 60.4R  Package: M2012  [Resistor_Smd_M2012_I0805]  (hidden comment: Resistor)
R606  value 60.4R  Package: M2012  [Resistor_Smd_M2012_I0805]  (hidden comment: Resistor)

### Ports
3.3V (in), 5V (in), Gnd (in), MCU (harness CAN)

### Harnesses
CAN: RX, TX

### Nets
3.3V: R600.1 ; port 3.3V
5V: R603.1 ; port 5V
Gcan: C601.2 C602.2 D600.A IC600.5(GND2) R601.1 R604.2
Gnd: C600.2 IC600.4(GND1) R604.1 ; port Gnd
Vcan: C601.1 IC600.8(VCC2) R602.1 R603.2
CAN_N: Conn600.2 D600.C2 IC600.6(CANL) R606.2
CAN_P: Conn600.3 D600.C1 IC600.7(CANH) R605.1
CanRx: IC600.2(RXD) ; port MCU.RX
CanTx: IC600.3(TXD) ; port MCU.TX
NetC600_1: C600.1 IC600.1(VCC1) R600.2
NetC602_1: C602.1 R605.2 R606.1
NetConn600_1: Conn600.1 R601.2
NetConn600_4: Conn600.4 R602.2

### Layout directives
differential pair; differential pair class Can_120: CAN_N, CAN_P

### Library data of the parts
C600-C602 = Capacitor_Ceramic: as C640 on sheet RS422; ComponentLink1Description: Datasheet; ComponentLink1URL: E:\Altium\Datasheets\Capacitor\Kyocera - X5R.pdf; ComponentLink2Description: Supplier Link; ComponentLink2URL: https://www.digikey.com/en/products/detail/kyocera-avx/04026D104KAT4A/8107673; Supplier: Digikey; Supplier Part Number: 478-11504-1-ND; Operating Temperature, Min: +85℃; Operating Temperature, Max: -55℃; Quantity, Min: 1; Quantity, Max: 250000; Price, Min: 0.1; Supplier Currency: $; Price, Max: 0.00189; Supplier Link: https://www.digikey.com/en/products/detail/kyocera-avx/04026D104KAT4A/8107673; Component Type: Ceramic; Component Category: Capacitor
Conn600 = Connector - 4P: Conn, JST, 4P, TH, XA, Side Entry; ComponentLink1Description: Datasheet; ComponentLink1URL: E:\Altium\Datasheets\Connector - JST\XA Family.pdf; ComponentLink2Description: Supplier Link; ComponentLink2URL: https://www.digikey.com/en/products/detail/jst-sales-america-inc/S04B-XASK-1-LF-SN/7230506; Supplier: Digikey; Supplier Part Number: 455-4090-ND; Manufacturer: JST; Operating Temperature, Min: -25℃; Operating Temperature, Max: +85℃; Quantity, Min: 1; Quantity, Max: 10000; Price, Min: 0.53; Supplier Currency: $; Price, Max: 0.22547; Supplier Link: https://www.digikey.com/en/products/detail/jst-sales-america-inc/S04B-XASK-1-LF-SN/7230506; Component Type: PCB; Component Category: Connector; Package: SMD, TH, Side Entry
D600 = Diode_Tvs_2P_Common_Anode: Diode, TVS, 5V/6.8V, SOD-723; Manufacturer Part Number: DF3A6.8LFV,L3F; Manufacturer: Toshiba; ComponentLink1Description: Datasheet; ComponentLink1URL: E:\Altium\Datasheets\Diode\Toshiba, DF3A6.8LFV.pdf; ComponentLink2Description: Supplier Link; ComponentLink2URL: https://www.digikey.com/en/products/detail/toshiba-semiconductor-and-storage/DF3A6-8LFV-L3F/4305070; Supplier: Digikey; Supplier Part Number: DF3A6.8LFVL3FCT-ND; Operating Temperature, Min: ---℃; Operating Temperature, Max: ---℃; Quantity, Min: 1; Quantity, Max: 200000; Price, Min: 0.25; Price, Max: 0.027; Supplier Currency: $; Supplier Link: https://www.digikey.com/en/products/detail/toshiba-semiconductor-and-storage/DF3A6-8LFV-L3F/4305070; Component Type: Tvs; Component Category: Diode
IC600 = CAN - Texas, ISO1050DUB: IC, Interface, CAN, DIP-8, Gull Wing; ComponentLink1Description: Datasheet; ComponentLink1URL: E:\Altium\Datasheets\IC - Interface\CAN - Texas, ISO1050.pdf; ComponentLink2Description: Supplier Link; ComponentLink2URL: https://www.digikey.com/en/products/detail/texas-instruments/ISO1050DUBR/2094633; Supplier: Digikey; Supplier Part Number: 296-24818-1-ND; Manufacturer: Texas; Operating Temperature, Min: -55℃; Operating Temperature, Max: +105℃; Quantity, Min: 1; Quantity, Max: 1050; Price, Min: 5.71; Supplier Currency: $; Price, Max: 3.25280; Supplier Link: https://www.digikey.com/en/products/detail/texas-instruments/ISO1050DUBR/2094633; Component Type: Interface; Component Category: IC; Package: DIP-8, Gull Wing
R600-R604 = Resistor: as R641 on sheet RS422; Component Category: Resistor; Component Type: Fixed Value; Tolerance: *; Supplier Link: https://www.digikey.com/en/products/detail/yageo/RC0402FR-070RL/2827570; Supplier Currency: $; Price, Max: 0.00109; Price, Min: 0.1; Quantity, Max: 50000; Quantity, Min: 1; Operating Temperature, Max: -55℃; Operating Temperature, Min: +155℃; Supplier Part Number: 311-0.0LRCT-ND; Supplier: Digikey; ComponentLink1Description: Datasheet; ComponentLink1URL: E:\Altium\Datasheets\Resistor\Yageo - RC_L Series.pdf; ComponentLink2Description: Supplier Link; ComponentLink2URL: https://www.digikey.com/en/products/detail/yageo/RC0402FR-070RL/2827570
R605 R606 = Resistor: as R640 on sheet RS422; Component Category: Resistor; Component Type: Fixed Value; Tolerance: 1%; Supplier Link: https://www.digikey.com/en/products/detail/yageo/RC0805FR-0760R4L/728073; Supplier Currency: $; Price, Max: 0.00328; Price, Min: 0.1; Quantity, Max: 125000; Quantity, Min: 1; Operating Temperature, Max: -55℃; Operating Temperature, Min: +155℃; Supplier Part Number: 311-60.4CRCT-ND; Supplier: Digikey; ComponentLink1Description: Datasheet; ComponentLink1URL: E:\Altium\Datasheets\Resistor\Yageo - RC_L Series.pdf; ComponentLink2Description: Supplier Link; ComponentLink2URL: https://www.digikey.com/en/products/detail/yageo/RC0805FR-0760R4L/728073